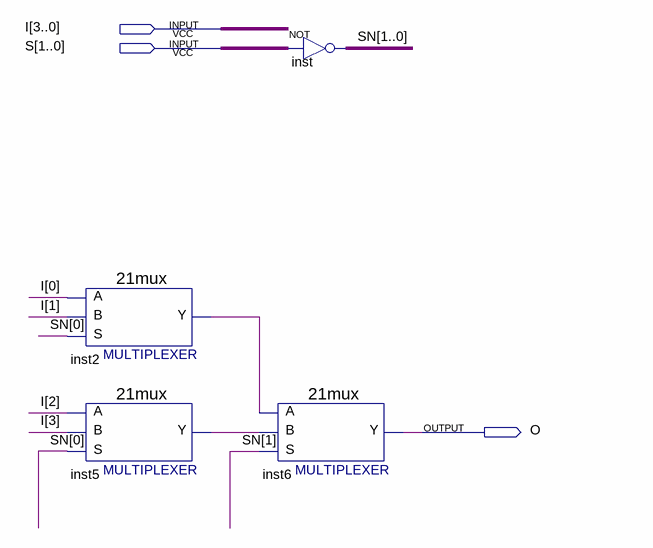
[diagram p0: schematic sheet]
// Quartus schematic mux4to1.bdf as structural Verilog: 4 symbols, 3 pins
module mux4to1 (
  input  [3:0] I,
  input  [1:0] S,
  output O
);

  wire inst2_y, inst5_y;
  wire [1:0] SN;

  \21mux  inst2 (.S(SN[0]), .B(I[1]), .A(I[0]), .Y(inst2_y));
  \21mux  inst5 (.S(SN[0]), .B(I[3]), .A(I[2]), .Y(inst5_y));
  \21mux  inst6 (.S(SN[1]), .B(inst5_y), .A(inst2_y), .Y(O));
  assign SN = ~S;  // NOT inst, 2 bits wide
endmodule
